# Altium schematic sheet PAGE03 FPGA IO.SchDoc
size 420 x 297 mm; SheetNumber: 3; SheetTotal: 9
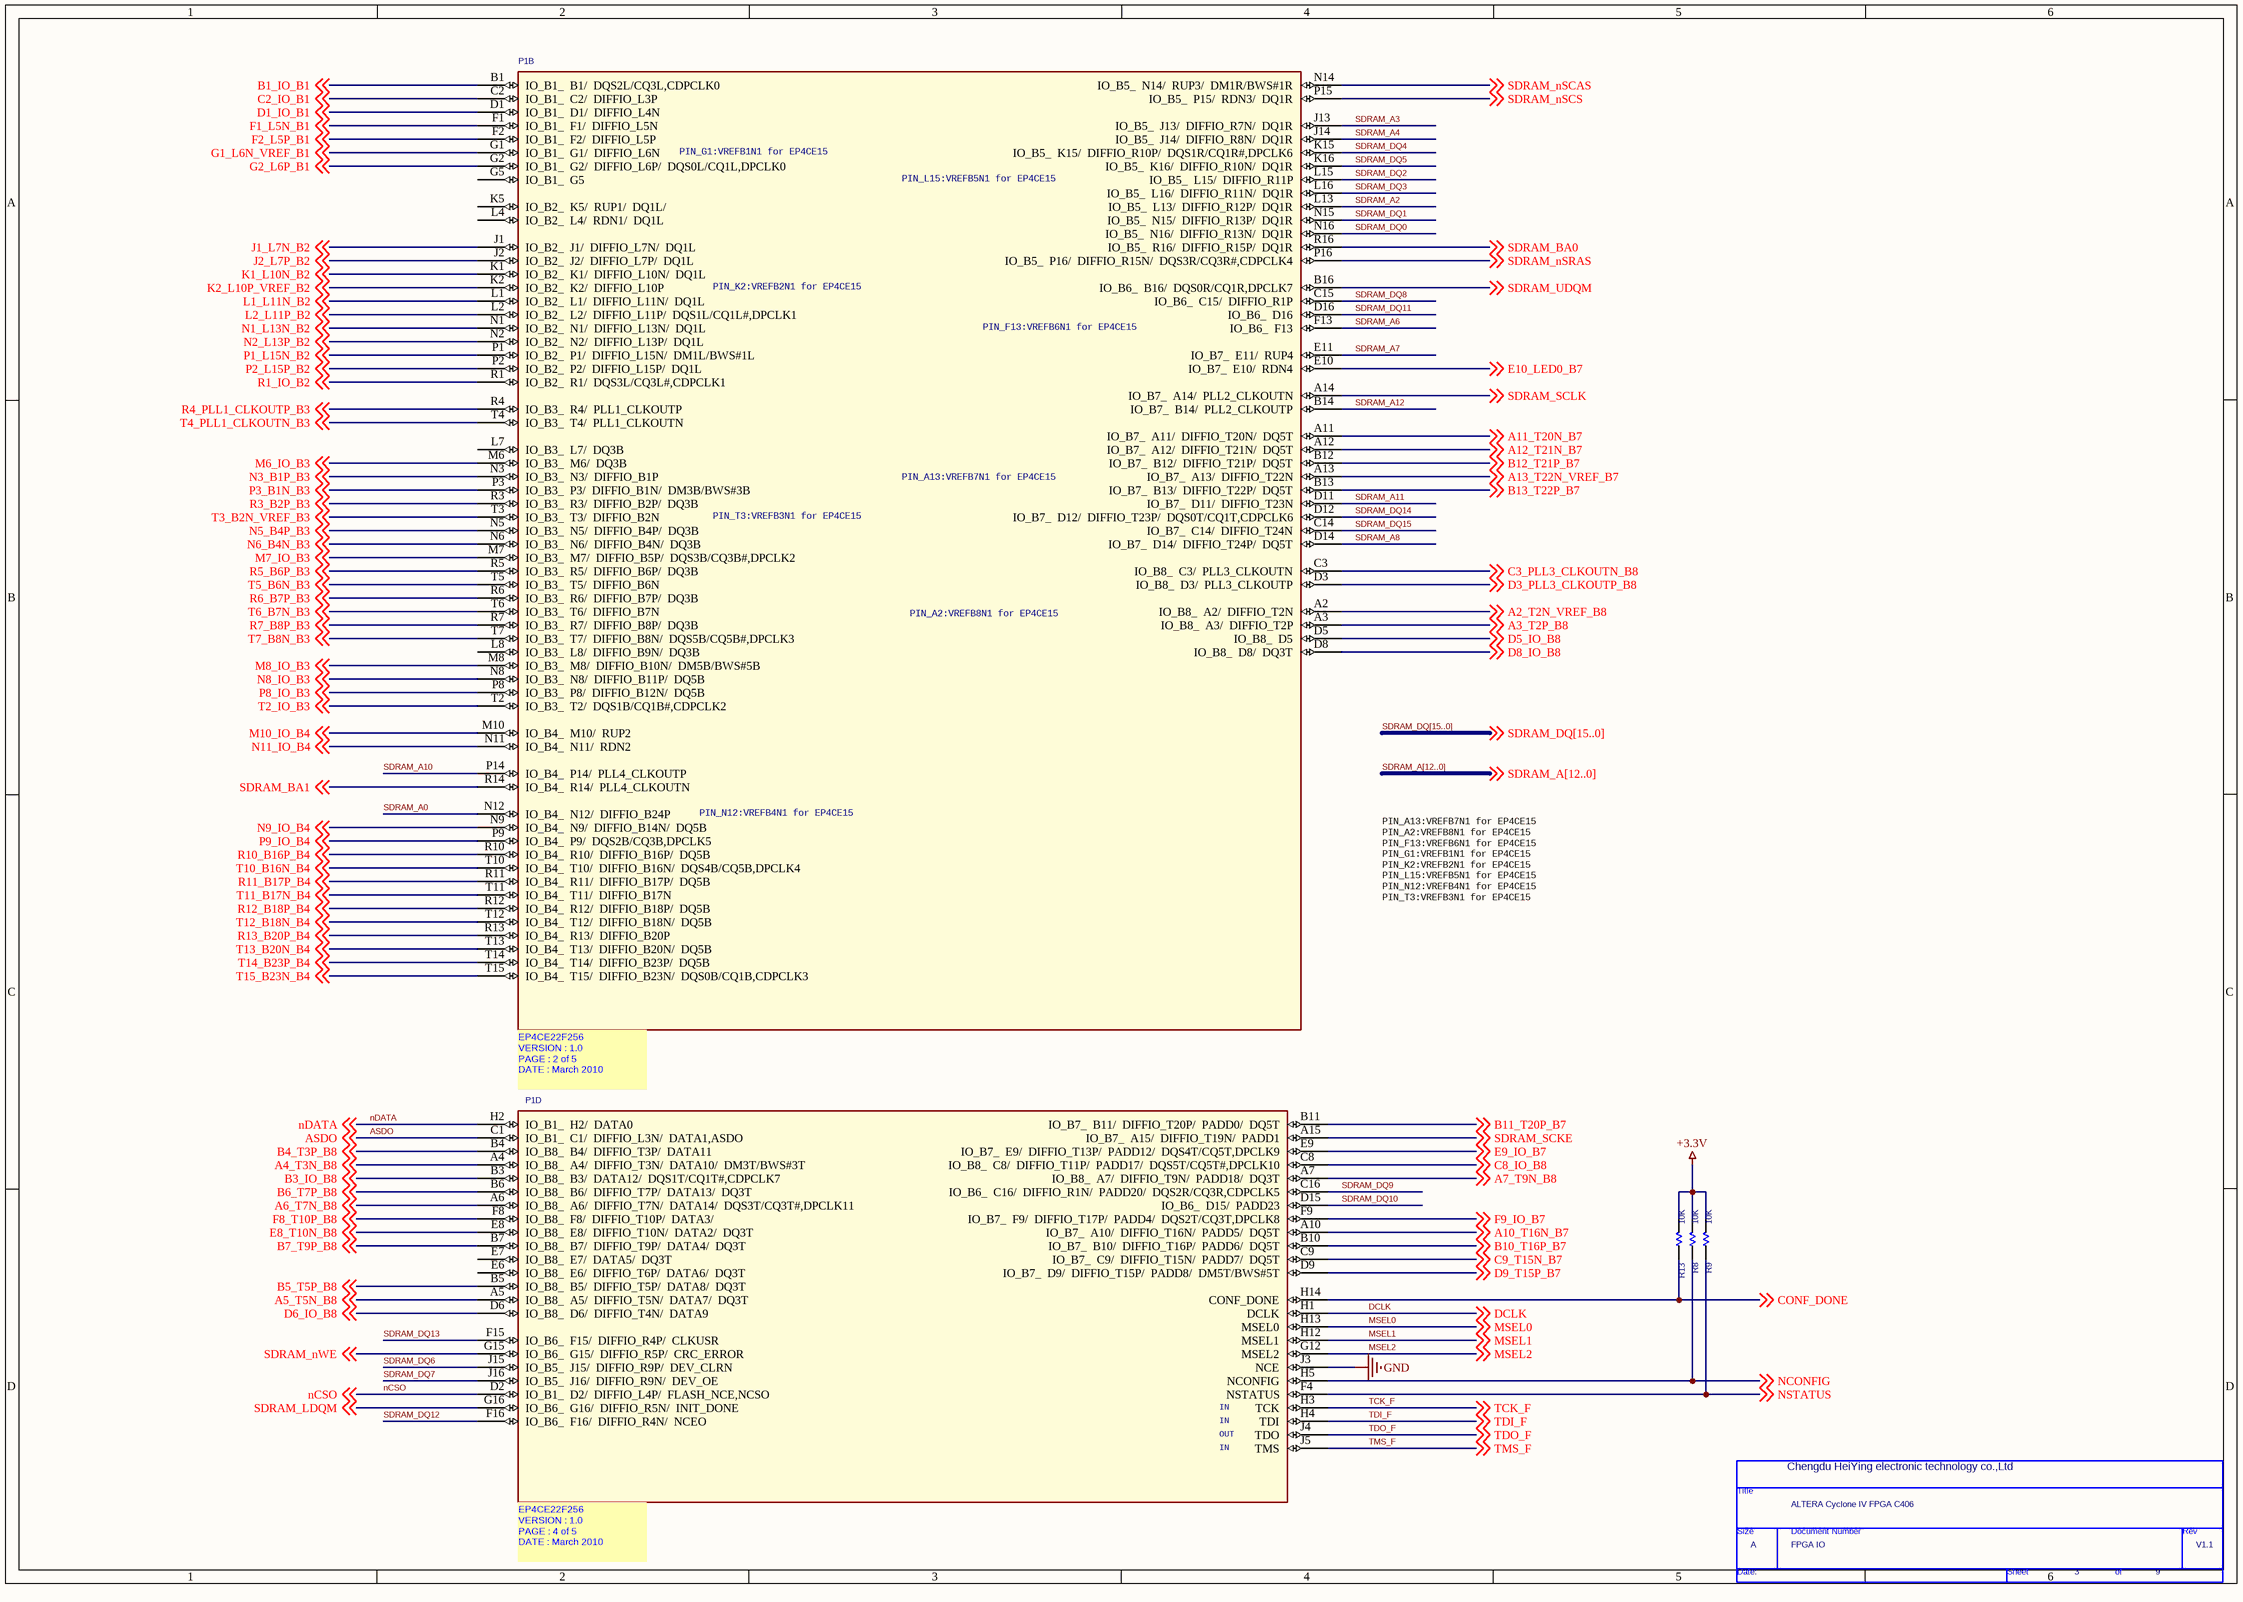
[diagram p0: PAGE03 FPGA IO.SchDoc]

## Parts
*  Page Count: 9  Page Number: 3  Page Size: A  Title: ALTERA Cyclone IV FPGA C406  RevCode: V1.1  Doc: FPGA IO  (hidden comment: TitleBlock0)  (graphical)
P1  EP4CE22F256  [fbga256_opt1]  (value not drawn)  (parts B,D of 5)
R8  10K  [R0402]
R9  10K  [R0402]
R13  10K  [R0402]

## Nets
+3.3V: R8.2 R9.2 R13.2
GND: P1.J3(NCE)
A2_T2N_VREF_B8: P1.A2(IO_B8___A2/__DIFFIO_T2N) ; off-sheet A2_T2N_VREF_B8
A3_T2P_B8: P1.A3(IO_B8___A3/__DIFFIO_T2P) ; off-sheet A3_T2P_B8
A4_T3N_B8: P1.A4(IO_B8___A4/__DIFFIO_T3N/__DATA10/__DM3T/BWS#3T) ; off-sheet A4_T3N_B8
A5_T5N_B8: P1.A5(IO_B8___A5/__DIFFIO_T5N/__DATA7/__DQ3T) ; off-sheet A5_T5N_B8
A6_T7N_B8: P1.A6(IO_B8___A6/__DIFFIO_T7N/__DATA14/__DQS3T/CQ3T#,DPCLK11) ; off-sheet A6_T7N_B8
A7_T9N_B8: P1.A7(IO_B8___A7/__DIFFIO_T9N/__PADD18/__DQ3T) ; off-sheet A7_T9N_B8
A10_T16N_B7: P1.A10(IO_B7___A10/__DIFFIO_T16N/__PADD5/__DQ5T) ; off-sheet A10_T16N_B7
A11_T20N_B7: P1.A11(IO_B7___A11/__DIFFIO_T20N/__DQ5T) ; off-sheet A11_T20N_B7
A12_T21N_B7: P1.A12(IO_B7___A12/__DIFFIO_T21N/__DQ5T) ; off-sheet A12_T21N_B7
A13_T22N_VREF_B7: P1.A13(IO_B7___A13/__DIFFIO_T22N) ; off-sheet A13_T22N_VREF_B7
ASDO: P1.C1(IO_B1___C1/__DIFFIO_L3N/__DATA1,ASDO) ; off-sheet ASDO
B1_IO_B1: P1.B1(IO_B1___B1/__DQS2L/CQ3L,CDPCLK0) ; off-sheet B1_IO_B1
B3_IO_B8: P1.B3(IO_B8___B3/__DATA12/__DQS1T/CQ1T#,CDPCLK7) ; off-sheet B3_IO_B8
B4_T3P_B8: P1.B4(IO_B8___B4/__DIFFIO_T3P/__DATA11) ; off-sheet B4_T3P_B8
B5_T5P_B8: P1.B5(IO_B8___B5/__DIFFIO_T5P/__DATA8/__DQ3T) ; off-sheet B5_T5P_B8
B6_T7P_B8: P1.B6(IO_B8___B6/__DIFFIO_T7P/__DATA13/__DQ3T) ; off-sheet B6_T7P_B8
B7_T9P_B8: P1.B7(IO_B8___B7/__DIFFIO_T9P/__DATA4/__DQ3T) ; off-sheet B7_T9P_B8
B10_T16P_B7: P1.B10(IO_B7___B10/__DIFFIO_T16P/__PADD6/__DQ5T) ; off-sheet B10_T16P_B7
B11_T20P_B7: P1.B11(IO_B7___B11/__DIFFIO_T20P/__PADD0/__DQ5T) ; off-sheet B11_T20P_B7
B12_T21P_B7: P1.B12(IO_B7___B12/__DIFFIO_T21P/__DQ5T) ; off-sheet B12_T21P_B7
B13_T22P_B7: P1.B13(IO_B7___B13/__DIFFIO_T22P/__DQ5T) ; off-sheet B13_T22P_B7
C2_IO_B1: P1.C2(IO_B1___C2/__DIFFIO_L3P) ; off-sheet C2_IO_B1
C3_PLL3_CLKOUTN_B8: P1.C3(IO_B8___C3/__PLL3_CLKOUTN) ; off-sheet C3_PLL3_CLKOUTN_B8
C8_IO_B8: P1.C8(IO_B8___C8/__DIFFIO_T11P/__PADD17/__DQS5T/CQ5T#,DPCLK10) ; off-sheet C8_IO_B8
C9_T15N_B7: P1.C9(IO_B7___C9/__DIFFIO_T15N/__PADD7/__DQ5T) ; off-sheet C9_T15N_B7
CONF_DONE: P1.H14(CONF_DONE) R13.1 ; off-sheet CONF_DONE
D1_IO_B1: P1.D1(IO_B1___D1/__DIFFIO_L4N) ; off-sheet D1_IO_B1
D3_PLL3_CLKOUTP_B8: P1.D3(IO_B8___D3/__PLL3_CLKOUTP) ; off-sheet D3_PLL3_CLKOUTP_B8
D5_IO_B8: P1.D5(IO_B8___D5) ; off-sheet D5_IO_B8
D6_IO_B8: P1.D6(IO_B8___D6/__DIFFIO_T4N/__DATA9) ; off-sheet D6_IO_B8
D8_IO_B8: P1.D8(IO_B8___D8/__DQ3T) ; off-sheet D8_IO_B8
D9_T15P_B7: P1.D9(IO_B7___D9/__DIFFIO_T15P/__PADD8/__DM5T/BWS#5T) ; off-sheet D9_T15P_B7
DCLK: P1.H1(DCLK) ; off-sheet DCLK
E8_T10N_B8: P1.E8(IO_B8___E8/__DIFFIO_T10N/__DATA2/__DQ3T) ; off-sheet E8_T10N_B8
E9_IO_B7: P1.E9(IO_B7___E9/__DIFFIO_T13P/__PADD12/__DQS4T/CQ5T,DPCLK9) ; off-sheet E9_IO_B7
E10_LED0_B7: P1.E10(IO_B7___E10/__RDN4) ; off-sheet E10_LED0_B7
F1_L5N_B1: P1.F1(IO_B1___F1/__DIFFIO_L5N) ; off-sheet F1_L5N_B1
F2_L5P_B1: P1.F2(IO_B1___F2/__DIFFIO_L5P) ; off-sheet F2_L5P_B1
F8_T10P_B8: P1.F8(IO_B8___F8/__DIFFIO_T10P/__DATA3/) ; off-sheet F8_T10P_B8
F9_IO_B7: P1.F9(IO_B7___F9/__DIFFIO_T17P/__PADD4/__DQS2T/CQ3T,DPCLK8) ; off-sheet F9_IO_B7
G1_L6N_VREF_B1: P1.G1(IO_B1___G1/__DIFFIO_L6N) ; off-sheet G1_L6N_VREF_B1
G2_L6P_B1: P1.G2(IO_B1___G2/__DIFFIO_L6P/__DQS0L/CQ1L,DPCLK0) ; off-sheet G2_L6P_B1
J1_L7N_B2: P1.J1(IO_B2___J1/__DIFFIO_L7N/__DQ1L) ; off-sheet J1_L7N_B2
J2_L7P_B2: P1.J2(IO_B2___J2/__DIFFIO_L7P/__DQ1L) ; off-sheet J2_L7P_B2
K1_L10N_B2: P1.K1(IO_B2___K1/__DIFFIO_L10N/__DQ1L) ; off-sheet K1_L10N_B2
K2_L10P_VREF_B2: P1.K2(IO_B2___K2/__DIFFIO_L10P) ; off-sheet K2_L10P_VREF_B2
L1_L11N_B2: P1.L1(IO_B2___L1/__DIFFIO_L11N/__DQ1L) ; off-sheet L1_L11N_B2
L2_L11P_B2: P1.L2(IO_B2___L2/__DIFFIO_L11P/__DQS1L/CQ1L#,DPCLK1) ; off-sheet L2_L11P_B2
M6_IO_B3: P1.M6(IO_B3___M6/__DQ3B) ; off-sheet M6_IO_B3
M7_IO_B3: P1.M7(IO_B3___M7/__DIFFIO_B5P/__DQS3B/CQ3B#,DPCLK2) ; off-sheet M7_IO_B3
M8_IO_B3: P1.M8(IO_B3___M8/__DIFFIO_B10N/__DM5B/BWS#5B) ; off-sheet M8_IO_B3
M10_IO_B4: P1.M10(IO_B4___M10/__RUP2) ; off-sheet M10_IO_B4
MSEL0: P1.H13(MSEL0) ; off-sheet MSEL0
MSEL1: P1.H12(MSEL1) ; off-sheet MSEL1
MSEL2: P1.G12(MSEL2) ; off-sheet MSEL2
N1_L13N_B2: P1.N1(IO_B2___N1/__DIFFIO_L13N/__DQ1L) ; off-sheet N1_L13N_B2
N2_L13P_B2: P1.N2(IO_B2___N2/__DIFFIO_L13P/__DQ1L) ; off-sheet N2_L13P_B2
N3_B1P_B3: P1.N3(IO_B3___N3/__DIFFIO_B1P) ; off-sheet N3_B1P_B3
N5_B4P_B3: P1.N5(IO_B3___N5/__DIFFIO_B4P/__DQ3B) ; off-sheet N5_B4P_B3
N6_B4N_B3: P1.N6(IO_B3___N6/__DIFFIO_B4N/__DQ3B) ; off-sheet N6_B4N_B3
N8_IO_B3: P1.N8(IO_B3___N8/__DIFFIO_B11P/__DQ5B) ; off-sheet N8_IO_B3
N9_IO_B4: P1.N9(IO_B4___N9/__DIFFIO_B14N/__DQ5B) ; off-sheet N9_IO_B4
N11_IO_B4: P1.N11(IO_B4___N11/__RDN2) ; off-sheet N11_IO_B4
NCONFIG: P1.H5(NCONFIG) R8.1 ; off-sheet NCONFIG
nCSO: P1.D2(IO_B1___D2/__DIFFIO_L4P/__FLASH_NCE,NCSO) ; off-sheet nCSO
nDATA: P1.H2(IO_B1___H2/__DATA0) ; off-sheet nDATA
NSTATUS: P1.F4(NSTATUS) R9.1 ; off-sheet NSTATUS
P1_L15N_B2: P1.P1(IO_B2___P1/__DIFFIO_L15N/__DM1L/BWS#1L) ; off-sheet P1_L15N_B2
P2_L15P_B2: P1.P2(IO_B2___P2/__DIFFIO_L15P/__DQ1L) ; off-sheet P2_L15P_B2
P3_B1N_B3: P1.P3(IO_B3___P3/__DIFFIO_B1N/__DM3B/BWS#3B) ; off-sheet P3_B1N_B3
P8_IO_B3: P1.P8(IO_B3___P8/__DIFFIO_B12N/__DQ5B) ; off-sheet P8_IO_B3
P9_IO_B4: P1.P9(IO_B4___P9/__DQS2B/CQ3B,DPCLK5) ; off-sheet P9_IO_B4
R1_IO_B2: P1.R1(IO_B2___R1/__DQS3L/CQ3L#,CDPCLK1) ; off-sheet R1_IO_B2
R3_B2P_B3: P1.R3(IO_B3___R3/__DIFFIO_B2P/__DQ3B) ; off-sheet R3_B2P_B3
R4_PLL1_CLKOUTP_B3: P1.R4(IO_B3___R4/__PLL1_CLKOUTP) ; off-sheet R4_PLL1_CLKOUTP_B3
R5_B6P_B3: P1.R5(IO_B3___R5/__DIFFIO_B6P/__DQ3B) ; off-sheet R5_B6P_B3
R6_B7P_B3: P1.R6(IO_B3___R6/__DIFFIO_B7P/__DQ3B) ; off-sheet R6_B7P_B3
R7_B8P_B3: P1.R7(IO_B3___R7/__DIFFIO_B8P/__DQ3B) ; off-sheet R7_B8P_B3
R10_B16P_B4: P1.R10(IO_B4___R10/__DIFFIO_B16P/__DQ5B) ; off-sheet R10_B16P_B4
R11_B17P_B4: P1.R11(IO_B4___R11/__DIFFIO_B17P/__DQ5B) ; off-sheet R11_B17P_B4
R12_B18P_B4: P1.R12(IO_B4___R12/__DIFFIO_B18P/__DQ5B) ; off-sheet R12_B18P_B4
R13_B20P_B4: P1.R13(IO_B4___R13/__DIFFIO_B20P) ; off-sheet R13_B20P_B4
SDRAM_A0: P1.N12(IO_B4___N12/__DIFFIO_B24P)
SDRAM_A2: P1.L13(IO_B5___L13/__DIFFIO_R12P/__DQ1R)
SDRAM_A3: P1.J13(IO_B5___J13/__DIFFIO_R7N/__DQ1R)
SDRAM_A4: P1.J14(IO_B5___J14/__DIFFIO_R8N/__DQ1R)
SDRAM_A6: P1.F13(IO_B6___F13)
SDRAM_A7: P1.E11(IO_B7___E11/__RUP4)
SDRAM_A8: P1.D14(IO_B7___D14/__DIFFIO_T24P/__DQ5T)
SDRAM_A10: P1.P14(IO_B4___P14/__PLL4_CLKOUTP)
SDRAM_A11: P1.D11(IO_B7___D11/__DIFFIO_T23N)
SDRAM_A12: P1.B14(IO_B7___B14/__PLL2_CLKOUTP)
SDRAM_BA0: P1.R16(IO_B5___R16/__DIFFIO_R15P/__DQ1R) ; off-sheet SDRAM_BA0
SDRAM_BA1: P1.R14(IO_B4___R14/__PLL4_CLKOUTN) ; off-sheet SDRAM_BA1
SDRAM_DQ0: P1.N16(IO_B5___N16/__DIFFIO_R13N/__DQ1R)
SDRAM_DQ1: P1.N15(IO_B5___N15/__DIFFIO_R13P/__DQ1R)
SDRAM_DQ2: P1.L15(IO_B5___L15/__DIFFIO_R11P)
SDRAM_DQ3: P1.L16(IO_B5___L16/__DIFFIO_R11N/__DQ1R)
SDRAM_DQ4: P1.K15(IO_B5___K15/__DIFFIO_R10P/__DQS1R/CQ1R#,DPCLK6)
SDRAM_DQ5: P1.K16(IO_B5___K16/__DIFFIO_R10N/__DQ1R)
SDRAM_DQ6: P1.J15(IO_B5___J15/__DIFFIO_R9P/__DEV_CLRN)
SDRAM_DQ7: P1.J16(IO_B5___J16/__DIFFIO_R9N/__DEV_OE)
SDRAM_DQ8: P1.C15(IO_B6___C15/__DIFFIO_R1P)
SDRAM_DQ9: P1.C16(IO_B6___C16/__DIFFIO_R1N/__PADD20/__DQS2R/CQ3R,CDPCLK5)
SDRAM_DQ10: P1.D15(IO_B6___D15/__PADD23)
SDRAM_DQ11: P1.D16(IO_B6___D16)
SDRAM_DQ12: P1.F16(IO_B6___F16/__DIFFIO_R4N/__NCEO)
SDRAM_DQ13: P1.F15(IO_B6___F15/__DIFFIO_R4P/__CLKUSR)
SDRAM_DQ14: P1.D12(IO_B7___D12/__DIFFIO_T23P/__DQS0T/CQ1T,CDPCLK6)
SDRAM_DQ15: P1.C14(IO_B7___C14/__DIFFIO_T24N)
SDRAM_LDQM: P1.G16(IO_B6___G16/__DIFFIO_R5N/__INIT_DONE) ; off-sheet SDRAM_LDQM
SDRAM_nSCAS: P1.N14(IO_B5___N14/__RUP3/__DM1R/BWS#1R) ; off-sheet SDRAM_nSCAS
SDRAM_nSCS: P1.P15(IO_B5___P15/__RDN3/__DQ1R) ; off-sheet SDRAM_nSCS
SDRAM_nSRAS: P1.P16(IO_B5___P16/__DIFFIO_R15N/__DQS3R/CQ3R#,CDPCLK4) ; off-sheet SDRAM_nSRAS
SDRAM_nWE: P1.G15(IO_B6___G15/__DIFFIO_R5P/__CRC_ERROR) ; off-sheet SDRAM_nWE
SDRAM_SCKE: P1.A15(IO_B7___A15/__DIFFIO_T19N/__PADD1) ; off-sheet SDRAM_SCKE
SDRAM_SCLK: P1.A14(IO_B7___A14/__PLL2_CLKOUTN) ; off-sheet SDRAM_SCLK
SDRAM_UDQM: P1.B16(IO_B6___B16/__DQS0R/CQ1R,DPCLK7) ; off-sheet SDRAM_UDQM
T2_IO_B3: P1.T2(IO_B3___T2/__DQS1B/CQ1B#,CDPCLK2) ; off-sheet T2_IO_B3
T3_B2N_VREF_B3: P1.T3(IO_B3___T3/__DIFFIO_B2N) ; off-sheet T3_B2N_VREF_B3
T4_PLL1_CLKOUTN_B3: P1.T4(IO_B3___T4/__PLL1_CLKOUTN) ; off-sheet T4_PLL1_CLKOUTN_B3
T5_B6N_B3: P1.T5(IO_B3___T5/__DIFFIO_B6N) ; off-sheet T5_B6N_B3
T6_B7N_B3: P1.T6(IO_B3___T6/__DIFFIO_B7N) ; off-sheet T6_B7N_B3
T7_B8N_B3: P1.T7(IO_B3___T7/__DIFFIO_B8N/__DQS5B/CQ5B#,DPCLK3) ; off-sheet T7_B8N_B3
T10_B16N_B4: P1.T10(IO_B4___T10/__DIFFIO_B16N/__DQS4B/CQ5B,DPCLK4) ; off-sheet T10_B16N_B4
T11_B17N_B4: P1.T11(IO_B4___T11/__DIFFIO_B17N) ; off-sheet T11_B17N_B4
T12_B18N_B4: P1.T12(IO_B4___T12/__DIFFIO_B18N/__DQ5B) ; off-sheet T12_B18N_B4
T13_B20N_B4: P1.T13(IO_B4___T13/__DIFFIO_B20N/__DQ5B) ; off-sheet T13_B20N_B4
T14_B23P_B4: P1.T14(IO_B4___T14/__DIFFIO_B23P/__DQ5B) ; off-sheet T14_B23P_B4
T15_B23N_B4: P1.T15(IO_B4___T15/__DIFFIO_B23N/__DQS0B/CQ1B,CDPCLK3) ; off-sheet T15_B23N_B4
TCK_F: P1.H3(TCK) ; off-sheet TCK_F
TDI_F: P1.H4(TDI) ; off-sheet TDI_F
TDO_F: P1.J4(TDO) ; off-sheet TDO_F
TMS_F: P1.J5(TMS) ; off-sheet TMS_F

Not connected (* = marked no-connect by the designer): P1 E6(IO_B8___E6/__DIFFIO_T6P/__DATA6/__DQ3T) E7(IO_B8___E7/__DATA5/__DQ3T) G5(IO_B1___G5) K5(IO_B2___K5/__RUP1/__DQ1L/) L4(IO_B2___L4/__RDN1/__DQ1L) L7(IO_B3___L7/__DQ3B) L8(IO_B3___L8/__DIFFIO_B9N/__DQ3B)

## Buses and harness runs
bus SDRAM_A[12..0]
bus SDRAM_DQ[15..0]

## Notes on the sheet
- (near P1) PIN_G1:VREFB1N1 for EP4CE15
- (near P1) PIN_L15:VREFB5N1 for EP4CE15
- (near P1) PIN_K2:VREFB2N1 for EP4CE15
- (near P1) PIN_F13:VREFB6N1 for EP4CE15
- (near P1) PIN_T3:VREFB3N1 for EP4CE15
- (near P1) PIN_A13:VREFB7N1 for EP4CE15
- (near P1) PIN_A2:VREFB8N1 for EP4CE15
- (near P1) PIN_N12:VREFB4N1 for EP4CE15
- PIN_A13:VREFB7N1 for EP4CE15
  PIN_A2:VREFB8N1 for EP4CE15
  PIN_F13:VREFB6N1 for EP4CE15
  PIN_G1:VREFB1N1 for EP4CE15
  PIN_K2:VREFB2N1 for EP4CE15
  PIN_L15:VREFB5N1 for EP4CE15
  PIN_N12:VREFB4N1 for EP4CE15
  PIN_T3:VREFB3N1 for EP4CE15
- (near P1) IN
- (near P1) OUT
- (near *) Chengdu HeiYing electronic technology co.,Ltd
- (in symbol EP4CE22F256, part B) EP4CE22F256 / VERSION : 1.0 / PAGE : 2 of 5 / DATE : March 2010 /
- (in symbol EP4CE22F256, part D) EP4CE22F256 / VERSION : 1.0 / PAGE : 4 of 5 / DATE : March 2010 /
- (in symbol TitleBlock0) Title; Size; Document Number; Rev; Date:; Sheet; of

## Library data of the parts
P1 = EP4CE22F256: SWAP_INFO: (S1+S2+S3+S4+S5); SPLIT_INST: TRUE
R8 R9 R13 = SMALL R1
* = TitleBlock0: Page Create Date: March  8, 1995